# EAGLE design xy-pad (EAGLE 9.6.2)
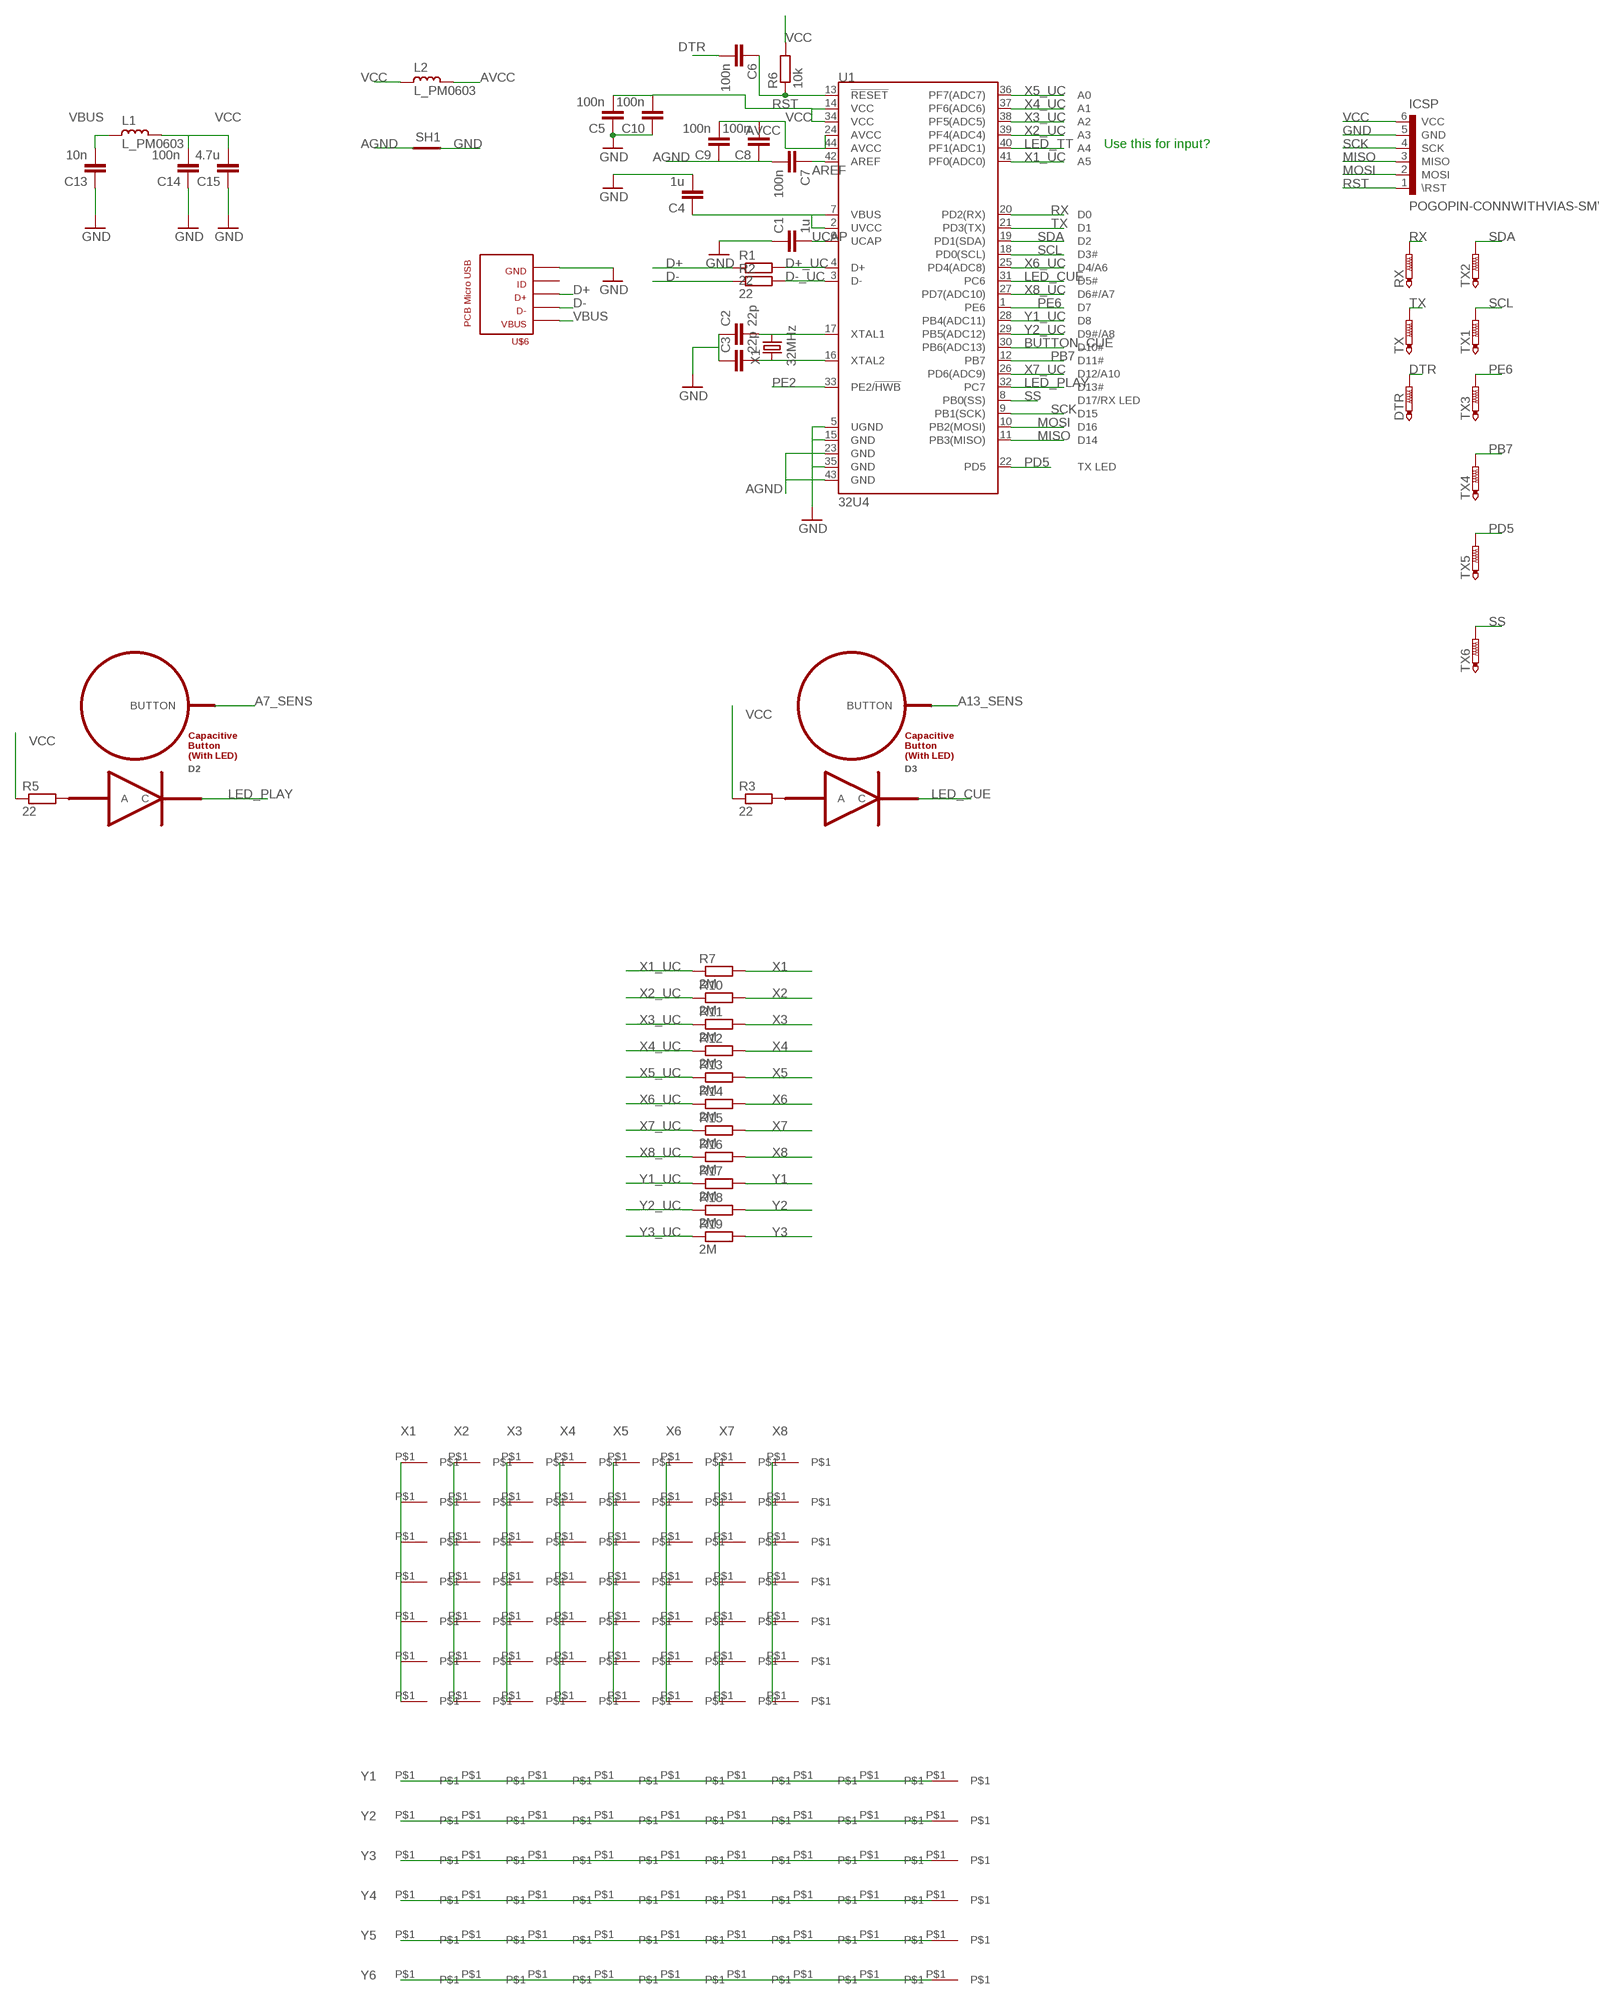
[diagram p0: schematic, sheet 1]

## Parts
C1  1u  C-EUC0402  [C0402]
C2  22p  C-EUC0402  [C0402]
C3  22p  C-EUC0402  [C0402]
C4  1u  C-EUC0402  [C0402]
C5  100n  C-EUC0402  [C0402]
C6  100n  C-EUC0402  [C0402]
C7  100n  C-EUC0402  [C0402]
C8  100n  C-EUC0402  [C0402]
C9  100n  C-EUC0402  [C0402]
C10  100n  C-EUC0402  [C0402]
C13  10n  C-EUC0402  [C0402]
C14  100n  C-EUC0402  [C0402]
C15  4.7u  C-EUC0402  [C0402]
D2  LED_BUTTON  [LED_BUTTON]
D3  LED_BUTTON  [LED_BUTTON]
DTR  PTR1TP06R  [TP06R]
ICSP  POGOPIN-CONNWITHVIAS-SMV  [POGOPROG-CONN-OH-SMALLERVIAS]
L1  L_PM0603  [PM0603]
L2  L_PM0603  [PM0603]
R1  22  R-EU_R0402  [R0402]
R2  22  R-EU_R0402  [R0402]
R3  22  R-EU_R0402  [R0402]
R5  22  R-EU_R0402  [R0402]
R6  10k  R-EU_R0402  [R0402]
R7  2M  R-EU_R0402  [R0402]
R10  2M  R-EU_R0402  [R0402]
R11  2M  R-EU_R0402  [R0402]
R12  2M  R-EU_R0402  [R0402]
R13  2M  R-EU_R0402  [R0402]
R14  2M  R-EU_R0402  [R0402]
R15  2M  R-EU_R0402  [R0402]
R16  2M  R-EU_R0402  [R0402]
R17  2M  R-EU_R0402  [R0402]
R18  2M  R-EU_R0402  [R0402]
R19  2M  R-EU_R0402  [R0402]
RX  PTR1TP06R  [TP06R]
SH1  SHORT  [SHORT_TOP-6]
TX  PTR1TP06R  [TP06R]
TX1  PTR1TP06R  [TP06R]
TX2  PTR1TP06R  [TP06R]
TX3  PTR1TP06R  [TP06R]
TX4  PTR1TP06R  [TP06R]
TX5  PTR1TP06R  [TP06R]
TX6  PTR1TP06R  [TP06R]
U1  32U4  ATMEGA32U4QFN  [QFN-44]
U$1  XY_PAD  [DIAMOND_PAD]
U$2  XY_PADTRIANGLE  [TRIANGLE_PAD]
U$3  XY_PADTRIANGLE  [TRIANGLE_PAD]
U$4  XY_PADTRIANGLE  [TRIANGLE_PAD]
U$5  XY_PADTRIANGLE  [TRIANGLE_PAD]
U$6  PCB_MICRO_USB_BSS_2  [USB_TYPE_B_SS_2]
U$7  XY_PADTRIANGLE  [TRIANGLE_PAD]
U$8  XY_PADTRIANGLE  [TRIANGLE_PAD]
U$9  XY_PADTRIANGLE  [TRIANGLE_PAD]
U$10  XY_PADTRIANGLE  [TRIANGLE_PAD]
U$11  XY_PAD  [DIAMOND_PAD]
U$12  XY_PAD  [DIAMOND_PAD]
U$13  XY_PAD  [DIAMOND_PAD]
U$14  XY_PAD  [DIAMOND_PAD]
U$15  XY_PAD  [DIAMOND_PAD]
U$16  XY_PAD  [DIAMOND_PAD]
U$17  XY_PAD  [DIAMOND_PAD]
U$18  XY_PAD  [DIAMOND_PAD]
U$19  XY_PAD  [DIAMOND_PAD]
U$20  XY_PAD  [DIAMOND_PAD]
U$21  XY_PAD  [DIAMOND_PAD]
U$22  XY_PAD  [DIAMOND_PAD]
U$23  XY_PAD  [DIAMOND_PAD]
U$24  XY_PAD  [DIAMOND_PAD]
U$25  XY_PAD  [DIAMOND_PAD]
U$26  XY_PAD  [DIAMOND_PAD]
U$27  XY_PAD  [DIAMOND_PAD]
U$28  XY_PAD  [DIAMOND_PAD]
U$29  XY_PAD  [DIAMOND_PAD]
U$30  XY_PAD  [DIAMOND_PAD]
U$31  XY_PAD  [DIAMOND_PAD]
U$32  XY_PAD  [DIAMOND_PAD]
U$33  XY_PAD  [DIAMOND_PAD]
U$34  XY_PAD  [DIAMOND_PAD]
U$35  XY_PAD  [DIAMOND_PAD]
U$36  XY_PAD  [DIAMOND_PAD]
U$37  XY_PAD  [DIAMOND_PAD]
U$38  XY_PAD  [DIAMOND_PAD]
U$39  XY_PAD  [DIAMOND_PAD]
U$40  XY_PAD  [DIAMOND_PAD]
U$41  XY_PAD  [DIAMOND_PAD]
U$42  XY_PAD  [DIAMOND_PAD]
U$43  XY_PAD  [DIAMOND_PAD]
U$44  XY_PAD  [DIAMOND_PAD]
U$45  XY_PAD  [DIAMOND_PAD]
U$46  XY_PAD  [DIAMOND_PAD]
U$47  XY_PAD  [DIAMOND_PAD]
U$48  XY_PAD  [DIAMOND_PAD]
U$49  XY_PAD  [DIAMOND_PAD]
U$50  XY_PADTRIANGLE  [TRIANGLE_PAD]
U$51  XY_PADTRIANGLE  [TRIANGLE_PAD]
U$52  XY_PADTRIANGLE  [TRIANGLE_PAD]
U$53  XY_PADTRIANGLE  [TRIANGLE_PAD]
U$54  XY_PADTRIANGLE  [TRIANGLE_PAD]
U$55  XY_PADTRIANGLE  [TRIANGLE_PAD]
U$56  XY_PADTRIANGLE  [TRIANGLE_PAD]
U$57  XY_PADTRIANGLE  [TRIANGLE_PAD]
U$58  XY_PADTRIANGLE  [TRIANGLE_PAD]
U$59  XY_PADTRIANGLE  [TRIANGLE_PAD]
U$60  XY_PADTRIANGLE  [TRIANGLE_PAD]
U$61  XY_PADTRIANGLE  [TRIANGLE_PAD]
U$62  XY_PADTRIANGLE  [TRIANGLE_PAD]
U$63  XY_PADTRIANGLE  [TRIANGLE_PAD]
U$64  XY_PAD  [DIAMOND_PAD]
U$65  XY_PAD  [DIAMOND_PAD]
U$66  XY_PAD  [DIAMOND_PAD]
U$67  XY_PAD  [DIAMOND_PAD]
U$68  XY_PAD  [DIAMOND_PAD]
U$69  XY_PAD  [DIAMOND_PAD]
U$70  XY_PAD  [DIAMOND_PAD]
U$71  XY_PAD  [DIAMOND_PAD]
U$72  XY_PAD  [DIAMOND_PAD]
U$73  XY_PAD  [DIAMOND_PAD]
U$74  XY_PAD  [DIAMOND_PAD]
U$75  XY_PAD  [DIAMOND_PAD]
U$76  XY_PAD  [DIAMOND_PAD]
U$77  XY_PAD  [DIAMOND_PAD]
U$78  XY_PAD  [DIAMOND_PAD]
U$79  XY_PAD  [DIAMOND_PAD]
U$80  XY_PAD  [DIAMOND_PAD]
U$81  XY_PAD  [DIAMOND_PAD]
U$82  XY_PAD  [DIAMOND_PAD]
U$83  XY_PAD  [DIAMOND_PAD]
U$84  XY_PAD  [DIAMOND_PAD]
U$85  XY_PAD  [DIAMOND_PAD]
U$86  XY_PAD  [DIAMOND_PAD]
U$87  XY_PAD  [DIAMOND_PAD]
U$88  XY_PAD  [DIAMOND_PAD]
U$89  XY_PAD  [DIAMOND_PAD]
U$90  XY_PAD  [DIAMOND_PAD]
U$91  XY_PAD  [DIAMOND_PAD]
U$92  XY_PAD  [DIAMOND_PAD]
U$93  XY_PAD  [DIAMOND_PAD]
U$94  XY_PAD  [DIAMOND_PAD]
U$95  XY_PAD  [DIAMOND_PAD]
U$96  XY_PAD  [DIAMOND_PAD]
U$97  XY_PAD  [DIAMOND_PAD]
U$98  XY_PAD  [DIAMOND_PAD]
U$99  XY_PAD  [DIAMOND_PAD]
U$100  XY_PAD  [DIAMOND_PAD]
U$101  XY_PAD  [DIAMOND_PAD]
U$102  XY_PAD  [DIAMOND_PAD]
U$103  XY_PAD  [DIAMOND_PAD]
U$104  XY_PAD  [DIAMOND_PAD]
U$105  XY_PAD  [DIAMOND_PAD]
U$106  XY_PADTRIANGLE  [TRIANGLE_PAD]
U$107  XY_PADTRIANGLE  [TRIANGLE_PAD]
U$108  XY_PADTRIANGLE  [TRIANGLE_PAD]
U$109  XY_PADTRIANGLE  [TRIANGLE_PAD]
U$110  XY_PADTRIANGLE  [TRIANGLE_PAD]
U$111  XY_PADTRIANGLE  [TRIANGLE_PAD]
X1  32MHz  CRYSTAL-32MHZ-SMD-2.0X1.6MM  [CRYSTAL-SMD-2.0X1.6MM]

## Nets
A7_SENS: D2.BUTTON
A13_SENS: D3.BUTTON
AGND: C7.2 C8.1 C9.1 SH1.1 U1.23(GND) U1.43(GND)
AREF: C7.1 U1.42(AREF)
AVCC: C8.2 C9.2 L2.1 U1.24(AVCC) U1.44(AVCC)
BUTTON_CUE: U1.30(PB6(ADC13))
D+: R1.1 U$6.3
D+_UC: R1.2 U1.4(D+)
D-: R2.1 U$6.2
D-_UC: R2.2 U1.3(D-)
DTR: C6.2 DTR.TP
GND: C1.1 C2.1 C3.1 C4.2 C5.1 C10.1 C13.1 C14.1 C15.1 ICSP.5(GND) SH1.2 U1.5(UGND) U1.15(GND) U1.35(GND) U$6.5
LED_CUE: D3.C U1.31(PC6)
LED_PLAY: D2.C U1.32(PC7)
LED_TT: U1.40(PF1(ADC1))
MISO: ICSP.3(MISO) U1.11(PB3(MISO))
MOSI: ICSP.2(MOSI) U1.10(PB2(MOSI))
N$6: D3.A R3.2
N$7: C2.2 U1.17(XTAL1) X1.3
N$8: C3.2 U1.16(XTAL2) X1.1
N$10: D2.A R5.2
PB7: TX4.TP U1.12(PB7)
PD5: TX5.TP U1.22(PD5)
PE2: U1.33(PE2/!HWB)
PE6: TX3.TP U1.1(PE6)
RST: C6.1 ICSP.1(\RST) R6.1 U1.13(!RESET)
RX: RX.TP U1.20(PD2(RX))
SCK: ICSP.4(SCK) U1.9(PB1(SCK))
SCL: TX1.TP U1.18(PD0(SCL))
SDA: TX2.TP U1.19(PD1(SDA))
SS: TX6.TP U1.8(PB0(SS))
TX: TX.TP U1.21(PD3(TX))
UCAP: C1.2 U1.6(UCAP)
VBUS: C13.2 L1.2 U$6.1
VCC: C4.1 C5.2 C10.2 C14.2 C15.2 ICSP.6(VCC) L1.1 L2.2 R3.1 R5.1 R6.2 U1.2(UVCC) U1.7(VBUS) U1.14(VCC) U1.34(VCC)
X1: R7.2 U$1.P$1 U$2.P$1 U$18.P$1 U$26.P$1 U$34.P$1 U$42.P$1 U$50.P$1
X1_UC: R7.1 U1.41(PF0(ADC0))
X2: R10.2 U$3.P$1 U$11.P$1 U$19.P$1 U$27.P$1 U$35.P$1 U$43.P$1 U$51.P$1
X2_UC: R10.1 U1.39(PF4(ADC4))
X3: R11.2 U$4.P$1 U$12.P$1 U$20.P$1 U$28.P$1 U$36.P$1 U$44.P$1 U$52.P$1
X3_UC: R11.1 U1.38(PF5(ADC5))
X4: R12.2 U$5.P$1 U$13.P$1 U$21.P$1 U$29.P$1 U$37.P$1 U$45.P$1 U$53.P$1
X4_UC: R12.1 U1.37(PF6(ADC6))
X5: R13.2 U$7.P$1 U$14.P$1 U$22.P$1 U$30.P$1 U$38.P$1 U$46.P$1 U$54.P$1
X5_UC: R13.1 U1.36(PF7(ADC7))
X6: R14.2 U$8.P$1 U$15.P$1 U$23.P$1 U$31.P$1 U$39.P$1 U$47.P$1 U$55.P$1
X6_UC: R14.1 U1.25(PD4(ADC8))
X7: R15.2 U$9.P$1 U$16.P$1 U$24.P$1 U$32.P$1 U$40.P$1 U$48.P$1 U$56.P$1
X7_UC: R15.1 U1.26(PD6(ADC9))
X8: R16.2 U$10.P$1 U$17.P$1 U$25.P$1 U$33.P$1 U$41.P$1 U$49.P$1 U$57.P$1
X8_UC: R16.1 U1.27(PD7(ADC10))
Y1: R17.2 U$63.P$1 U$69.P$1 U$75.P$1 U$81.P$1 U$87.P$1 U$93.P$1 U$99.P$1 U$105.P$1 U$111.P$1
Y1_UC: R17.1 U1.28(PB4(ADC11))
Y2: R18.2 U$62.P$1 U$68.P$1 U$74.P$1 U$80.P$1 U$86.P$1 U$92.P$1 U$98.P$1 U$104.P$1 U$110.P$1
Y2_UC: R18.1 U1.29(PB5(ADC12))
Y3: R19.2 U$61.P$1 U$67.P$1 U$73.P$1 U$79.P$1 U$85.P$1 U$91.P$1 U$97.P$1 U$103.P$1 U$109.P$1
Y3_UC: R19.1
Y4: U$60.P$1 U$66.P$1 U$72.P$1 U$78.P$1 U$84.P$1 U$90.P$1 U$96.P$1 U$102.P$1 U$108.P$1
Y5: U$59.P$1 U$65.P$1 U$71.P$1 U$77.P$1 U$83.P$1 U$89.P$1 U$95.P$1 U$101.P$1 U$107.P$1
Y6: U$58.P$1 U$64.P$1 U$70.P$1 U$76.P$1 U$82.P$1 U$88.P$1 U$94.P$1 U$100.P$1 U$106.P$1
Unconnected: U$6.4

## Notes on the sheet
- Use this for input?

## Library data of the parts
C1-C10 C13-C15 = rcl:C-EU: CAPACITOR, European symbol; SPICEPREFIX: C
D2 D3 = credit_card_midi:LED_BUTTON
DTR RX TX TX1-TX6 = testpad:PTR1: TEST PIN
ICSP = Protofusion:POGOPIN-CONN: Protofusion custom pogo pin programming header
L1 L2 = rc-master-smd:L_: INDUCTOR
R1-R3 R5-R7 R10-R19 = rcl:R-EU_: RESISTOR, European symbol; SPICEPREFIX: R
SH1 = shorts:SHORT: Short between two nets
U1 = SparkFun-IC-Microcontroller:ATMEGA32U4: Atmel MCU, 32KByte Atmel 44-pin 8-bit Microcontroller with 32KBytes of ISP Flash and USB Controller Datasheet <http://cdn.sparkfun.com/datasheets/Dev/Arduino/Boards/ATMega32U4.pdf> SparkFun Products LilyPad Arduino USB - ATmega32U4 Board <https://www.sparkfun.com/products/12049> (DEV-12049) Pro Micro - 5V/16MHz <https://www.sparkfun.com/products/12640> (DEV-12640) Pro Micro - 3.3V/8MHz <https://www.sparkfun.com/products/12587> (DEV-12587) Fio v3 - ATmega32U4 <https://www.sparkfun.com/products/11520> (DEV-11520) Qduino Mini <https://www.sparkfun.com/products/13614> (DEV-13614) Makey Makey - Standard Kit <https://www.sparkfun.com/products/11511> (WIG-11511) Makey Makey Deluxe Kit <https://www.sparkfun.com/products/11519> (WIG-11519); PROD_ID: IC-10828
U$1-U$5 U$7-U$111 = credit_card_midi:XY_PAD
U$6 = USB_pcb_connectors:PCB_MICRO_USB_B
X1 = SparkFun-Clocks:CRYSTAL-32MHZ: 32MHz Crystal Digikey Example <http://www.digikey.com/product-detail/en/murata-electronics-north-america/XRCGB32M000F2P00R0/490-9769-1-ND/4952013> Frequency: 32MHz Frequency Stability: ±20ppm Frequency Tolerance: ±20ppm Load Capacitance: 6pF SparkFun Products SparkFun nRF52832 Breakout <https://www.sparkfun.com/products/13990>; PROD_ID: XTAL-13459

## Board
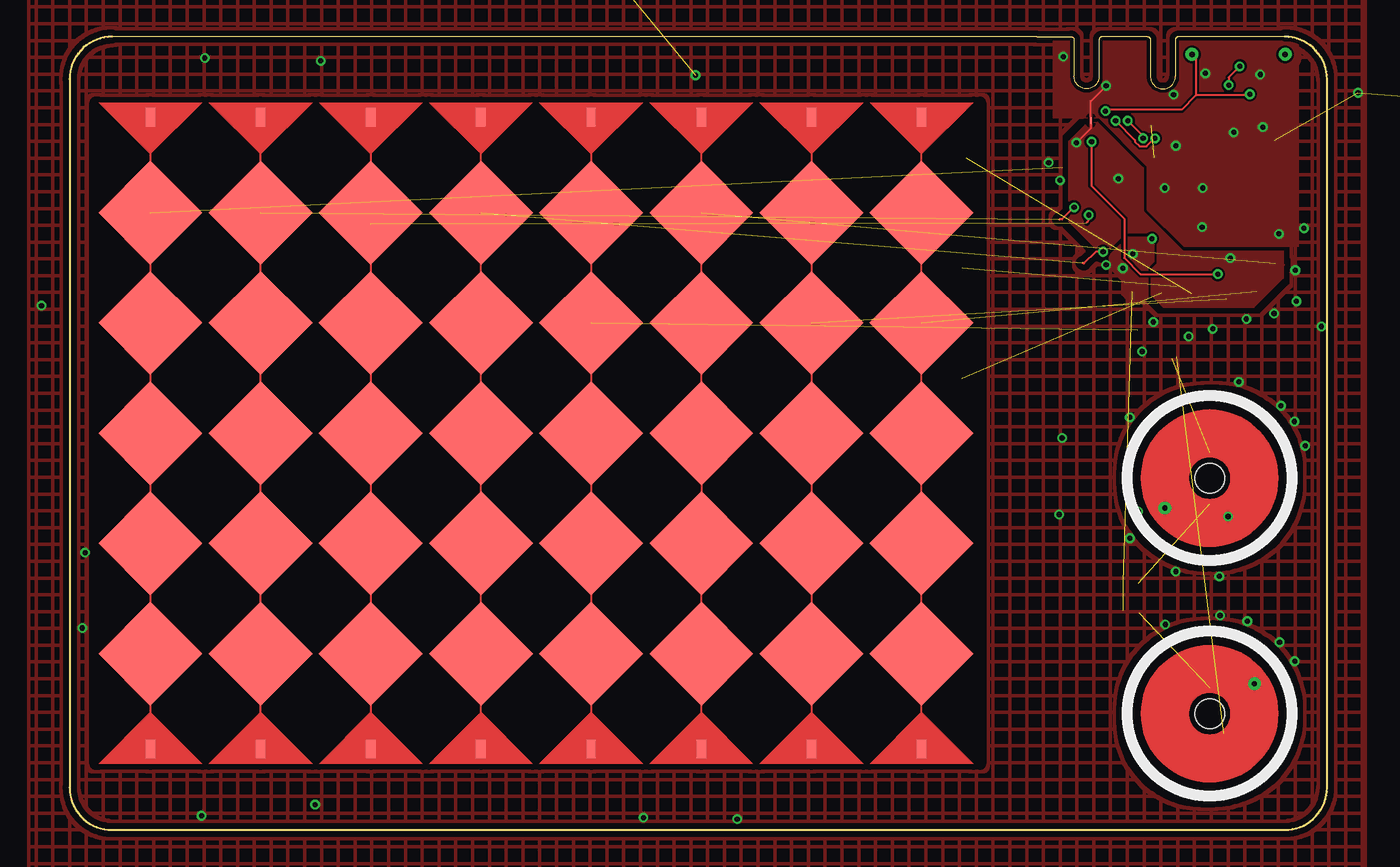
[diagram p1: board, top side]
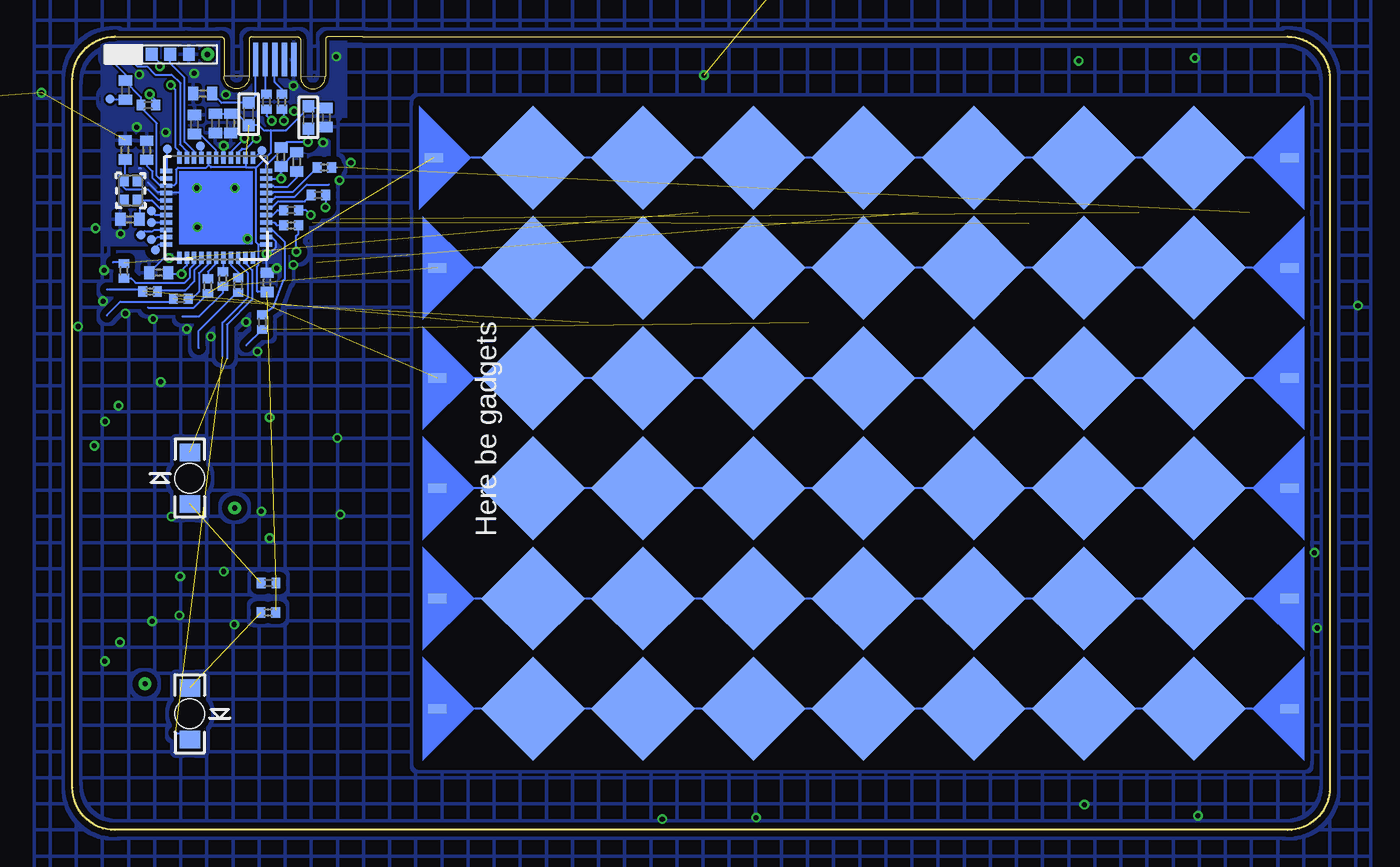
[diagram p2: board, bottom side, seen from below]

Size 85.6 x 53.98 mm. Coordinates in mm from the lower left corner, seen from the top.
Outline: 77.83,53.98 82.72,53.98 arc-90 85.6,51.1 85.6,2.88 arc-90 82.72,0 2.88,0 arc-90 0,2.88 0,51.1 arc-90 2.88,53.98 65.84,53.98
Copper layers (1*16): Top 0.035mm / dielectric 1.5mm / Bottom 0.035mm
Design rules "SeeedStudio_2layer_DRU_no_angle_20140221": minimum track width 6mil, minimum drill 12mil, track to track 6mil, track to pad 6mil, pad to pad 6mil, via to via 6mil, smd to smd 0mil, copper to edge 10mil, drill to drill 10mil, minimum pad ring 10mil, minimum via ring 6mil, stop-mask expansion 2mil, vias tented up to drill 100mil, thermal gap 10mil
tRestrict: area 1.8,4.5 to 62,49.5
bRestrict: area 1.8,4.5 to 62,49.5

### Footprints (pad centres in the part's own frame; a part is rotated, then mirrored left to right if it is on the bottom)
C0402 = smd 0.7 x 0.9: 1 -0.65,0; 2 0.65,0
LED_BUTTON = smd 1.2 x 1.4 bottom: A -1.754,0; C 1.754,0 | drill 0.356: BUTTON -2.032,3.048 | hole 2: 0,0
TP06R = smd 0.6 x 0.6: TP 0,0
POGOPROG-CONN-OH-SMALLERVIAS = drill 0.381: 1 0,2.54; 6 0,-3.81 | smd 0.889 x 0.813: 2 0,1.27; 3 0,0; 4 0,-1.27; 5 0,-2.54
PM0603 = smd 0.8 x 0.8: 1 -0.762,0; 2 0.762,0
R0402 = smd 0.6 x 0.7: 1 -0.5,0; 2 0.5,0
SHORT_TOP-6 = smd 0.305 x 0.152: 1 0.051,0; 2 -0.076,0
QFN-44 = smd 0.8 x 0.3: 1 -3.4,2.5; 2 -3.4,2; 3 -3.4,1.5; 4 -3.4,1; 5 -3.4,0.5; 6 -3.4,0; 7 -3.4,-0.5; 8 -3.4,-1; 9 -3.4,-1.5; 10 -3.4,-2; 11 -3.4,-2.5; 23 3.4,-2.5; 24 3.4,-2; 25 3.4,-1.5; 26 3.4,-1; 27 3.4,-0.5; 28 3.4,0; 29 3.4,0.5; 30 3.4,1; 31 3.4,1.5; 32 3.4,2; 33 3.4,2.5 | smd 0.3 x 0.8: 12 -2.5,-3.4; 13 -2,-3.4; 14 -1.5,-3.4; 15 -1,-3.4; 16 -0.5,-3.4; 17 0,-3.4; 18 0.5,-3.4; 19 1,-3.4; 20 1.5,-3.4; 21 2,-3.4; 22 2.5,-3.4; 34 2.5,3.4; 35 2,3.4; 36 1.5,3.4; 37 1,3.4; 38 0.5,3.4; 39 0,3.4; 40 -0.5,3.4; 41 -1,3.4; 42 -1.5,3.4; 43 -2,3.4; 44 -2.5,3.4
DIAMOND_PAD = smd 5 x 5 rotated 45: P$1 0,0
TRIANGLE_PAD = smd 1.27 x 0.635: P$1 1,0
USB_TYPE_B_SS_2 = smd 0.37 x 2.3: 1 -1.3,-1.55; 2 -0.65,-1.55; 3 0,-1.55; 4 0.65,-1.55; 5 1.3,-1.55
CRYSTAL-SMD-2.0X1.6MM = smd 0.75 x 0.7: 1 -0.675,-0.5; 2 0.675,-0.5; 3 0.675,0.5; 4 -0.675,0.5

### Placement (x,y rotation side)
C1  77.29,48.01 270 bottom
C2  81.69,41.55 0 bottom
C3  82.02,46.28 270 bottom
C4  68.33,48.49 270 bottom
C5  80.54,46.25 270 bottom
C6  81.99,50.34 270 bottom
C7  70.33,45.47 90 bottom
C8  79.73,37.92 0 bottom
C9  71.4,45.8 90 bottom
C10  72.35,37.26 270 bottom
C13  76.73,50.11 0 bottom
C14  75.87,48.08 90 bottom
C15  74.83,48.08 90 bottom
D2  77.61,23.94 90 top
D3  77.61,7.91 270 top
DTR  83.03,49.73 0 bottom
ICSP  80.21,52.78 90 bottom
L1  73.61,48.72 90 bottom
L2  69.55,48.49 90 bottom
R1  71.35,49.56 270 bottom
R2  72.39,49.56 270 bottom
R3  72.28,14.8 180 bottom
R5  72.25,16.8 180 bottom
R6  80.44,49.33 0 bottom
R7  68.45,45.09 0 bottom
R10  68.86,43.21 0 bottom
R11  70.71,42.18 0 bottom
R12  70.71,41.15 0 bottom
R13  72.68,34.56 270 bottom
R14  82.09,38.05 90 bottom
R15  80.31,36.65 180 bottom
R16  78.23,36.14 180 bottom
R17  76.38,37.01 270 bottom
R18  75.35,37.49 270 bottom
R19  74.32,37.07 270 bottom
RX  80.95,40.49 0 bottom
SH1  69.52,48.27 270 top
TX  80.24,40.18 0 bottom
TX1  80.24,42.11 0 bottom
TX2  80.21,41.35 0 bottom
TX3  72.69,46.25 0 bottom
TX4  79.15,46.33 0 bottom
TX5  79.96,39.47 0 bottom
TX6  76.89,46.53 0 bottom
U1  75.82,42.34 270 bottom
U$1  5.5,42 0 top
U$2  5.5,49.5 270 top
U$3  13,49.5 270 top
U$4  20.5,49.5 270 top
U$5  28,49.5 270 top
U$6  71.83,53.98 0 bottom
U$7  35.5,49.5 270 top
U$8  43,49.5 270 top
U$9  58,49.5 270 top
U$10  50.5,49.5 270 top
U$11  13,42 0 top
U$12  20.5,42 0 top
U$13  28,42 0 top
U$14  35.5,42 0 top
U$15  43,42 0 top
U$16  58,42 0 top
U$17  50.5,42 0 top
U$18  5.5,34.5 180 top
U$19  13,34.5 90 top
U$20  20.5,34.5 90 top
U$21  28,34.5 90 top
U$22  35.5,34.5 90 top
U$23  43,34.5 90 top
U$24  58,34.5 90 top
U$25  50.5,34.5 90 top
U$26  5.5,27 90 top
U$27  13,27 90 top
U$28  20.5,27 90 top
U$29  28,27 90 top
U$30  35.5,27 90 top
U$31  43,27 90 top
U$32  58,27 90 top
U$33  50.5,27 90 top
U$34  5.5,19.5 90 top
U$35  13,19.5 90 top
U$36  20.5,19.5 90 top
U$37  28,19.5 90 top
U$38  35.5,19.5 90 top
U$39  43,19.5 90 top
U$40  58,19.5 90 top
U$41  50.5,19.5 90 top
U$42  5.5,12 0 top
U$43  13,12 0 top
U$44  20.5,12 0 top
U$45  28,12 0 top
U$46  35.5,12 0 top
U$47  43,12 0 top
U$48  58,12 0 top
U$49  50.5,12 0 top
U$50  5.5,4.5 90 top
U$51  13,4.5 90 top
U$52  20.5,4.5 90 top
U$53  28,4.5 90 top
U$54  35.5,4.5 90 top
U$55  43,4.5 90 top
U$56  58,4.5 90 top
U$57  50.5,4.5 90 top
U$58  1.75,8.25 180 bottom
U$59  1.75,15.75 180 bottom
U$60  1.75,23.25 180 bottom
U$61  1.75,30.75 180 bottom
U$62  1.75,38.25 180 bottom
U$63  1.75,45.75 180 bottom
U$64  9.25,8.25 0 bottom
U$65  9.25,15.75 0 bottom
U$66  9.25,23.25 0 bottom
U$67  9.25,30.75 0 bottom
U$68  9.25,38.25 0 bottom
U$69  9.25,45.75 0 bottom
U$70  16.75,8.25 0 bottom
U$71  16.75,15.75 0 bottom
U$72  16.75,23.25 0 bottom
U$73  16.75,30.75 0 bottom
U$74  16.75,38.25 0 bottom
U$75  16.75,45.75 0 bottom
U$76  24.25,8.25 0 bottom
U$77  24.25,15.75 0 bottom
U$78  24.25,23.25 0 bottom
U$79  24.25,30.75 0 bottom
U$80  24.25,38.25 0 bottom
U$81  24.25,45.75 0 bottom
U$82  31.75,8.25 0 bottom
U$83  31.75,15.75 0 bottom
U$84  31.75,23.25 0 bottom
U$85  31.75,30.75 0 bottom
U$86  31.75,38.25 0 bottom
U$87  31.75,45.75 0 bottom
U$88  39.25,8.25 0 bottom
U$89  39.25,15.75 0 bottom
U$90  39.25,23.25 0 bottom
U$91  39.25,30.75 0 bottom
U$92  39.25,38.25 0 bottom
U$93  39.25,45.75 0 bottom
U$94  46.75,8.25 0 bottom
U$95  46.75,15.75 0 bottom
U$96  46.75,23.25 0 bottom
U$97  46.75,30.75 0 bottom
U$98  46.75,38.25 0 bottom
U$99  46.75,45.75 0 bottom
U$100  54.25,8.25 0 bottom
U$101  54.25,15.75 0 bottom
U$102  54.25,23.25 0 bottom
U$103  54.25,30.75 0 bottom
U$104  54.25,38.25 0 bottom
U$105  54.25,45.75 0 bottom
U$106  61.75,8.25 0 bottom
U$107  61.75,15.75 0 bottom
U$108  61.75,23.25 0 bottom
U$109  61.75,30.75 0 bottom
U$110  61.75,38.25 0 bottom
U$111  62,45.75 0 bottom
X1  81.64,43.51 270 bottom

### Tracks (layer width: path | path; a pad name or v marks a point on that pad's centre or on a via)
A7_SENS
  Bottom 0.152: 74.51,21.96 D2.BUTTON
A13_SENS
  Bottom 0.152: 80.68,9.94 D3.BUTTON
AGND  (via drill 0.35)
  Top 0.152: SH1.1 69.52,47.76 v68.54,46.78
  Bottom 0.152: U1.43 72.4,44.33 v71.4,44.33 C9.1 70.43,46.12 C7.2 | v79.02,38.91 79.39,38.91 C8.1
  pour Bottom (isolate 0.406): 82.6,38.38 82.6,37.57 80.59,35.56 74.5,35.56 73.69,36.37 73.69,38.15 74.09,38.56 74.09,40.64 71.86,40.64 70.84,39.62 69.82,39.62 68.05,41.4 68.05,46.86 68.66,47.47 70.64,47.47 73.08,45.03 73.08,42.09 75.77,39.4 82.61,39.4 82.6,39.38 82.6,38.53 82.68,38.45
  pour Top: 82.6,38.38 82.6,37.57 80.59,35.56 74.5,35.56 73.69,36.37 73.69,38.15 74.09,38.56 74.09,40.64 71.86,40.64 70.84,39.62 69.82,39.62 68.05,41.4 68.05,46.86 69.32,48.13 69.98,48.13 73.08,45.03 73.08,42.09 75.77,39.4 82.61,39.4 82.6,39.38 82.6,38.53 82.68,38.45
AREF
  Bottom 0.152: U1.42 71.93,43.84 71.86,43.77 70.96,43.77 70.33,44.4 C7.1
AVCC  (via drill 0.35)
  Top 0.152: v69.57,46.83 69.57,43.83 71.79,41.6 71.79,38.93 72.9,37.82 v78.16,37.82
  Bottom 0.152: U1.44 72.42,45.25 71.4,46.27 C9.2 71.01,46.83 v69.57,46.83 69.57,47.73 L2.1 | U1.24 77.82,38.42 78.16,38.08 78.16,37.85 | 78.16,37.85 v78.16,37.82 | C8.2 79,37.85 78.16,37.85
BUTTON_CUE
  Bottom 0.152: U1.30 74.82,38.45 74.29,37.91 74.29,37.6
D+
  Bottom 0.152: R1.1 71.35,50.41 71.83,50.89 U$6.3
D+_UC  (via drill 0.35)
  Top 0.152: v73.89,47.07 73.86,47.07 73.31,46.52 72.85,46.52 72.53,46.84 72.53,46.95 v71.21,48.27
  Bottom 0.152: U1.4 74.82,46.14 v73.89,47.07 | v71.21,48.27 71.22,48.28 71.22,48.93 R1.2
D-
  Bottom 0.152: R2.1 72.47,50.13 72.47,52.41 U$6.2
D-_UC  (via drill 0.35)
  Top 0.152: v72.03,48.26 73.08,47.21 v73.08,47.08
  Bottom 0.152: U1.3 74.33,46.11 74.06,46.37 73.79,46.37 v73.08,47.08 | R2.2 72.39,48.62 v72.03,48.26
DTR
  Bottom 0.152: C6.2 82.73,49.69 82.77,49.73 DTR.TP
GND  (via drill 0.35)  (4 unrouted)
  Top 0.152: SH1.2 69.52,49.61 v70.56,50.65
  Bottom 0.152: U1.5 v75.32,46.55 v75.31,46.56 | 80.93,45.02 81.09,45.02 | 80.47,44.06 79.79,43.39 79.26,43.39 U1.15 79.24,43.36 77.47,43.36 v77.14,43.69 | C10.1 72.38,37.94 v72.38,39.2 72.28,39.1 71.77,39.61 71.77,40.07 72.04,40.34 U1.35
  other vias: 81.23,47.83 77.32,51.49 82.32,40.56 45.44,0.74 72.17,28.08 82.46,28.87 79.25,47.47 80.11,34.77 77.81,34.1 76.19,33.58 81.99,35.14 83.52,35.98 83.44,38.09 78.87,21.34 99.57,49.94 9.2,52.54 1.05,18.87 16.71,1.72 72.75,21.68 67.56,26.67 85.22,34.26 84.02,40.94 87.71,50.16 93.57,49.73 0.87,13.74 8.99,0.97 -1.91,35.68 17.09,52.34 83.38,27.8 79.59,30.49 67.36,21.46 72.17,19.85 74.59,13.98 75.3,17.59 78.27,17.26 78.32,14.59 37.38,57.75 66.65,45.42 42.61,51.36 74.55,43.69 84.11,26.15 70.56,38.46 77.09,41.02 73.69,40.23 81.05,51.41 67.64,52.63 73.77,34.57 75.16,50.04 67.42,44.21 71.7,38.23 82.37,12.78 83.4,11.48 39.06,0.84 73.01,32.56 80.18,14.2
  pour Top (isolate 0.406, rank 2, hatched): -2.77,56.59 -2.77,-3.02 88.19,-3.02 88.19,56.59
  pour Bottom (isolate 0.406, rank 2, hatched): -2.77,56.46 -2.77,-3.12 88.19,-3.12 88.19,56.46
  pour Top: 66.97,54.01 66.97,48.49 70.07,48.49 73.38,45.17 73.38,42.21 75.85,39.74 83.64,39.71 83.64,54.28 81.38,56.54 69.49,56.54
  pour Bottom: 66.97,54.01 66.97,48.49 70.07,48.49 73.38,45.17 73.38,42.21 75.85,39.74 83.62,39.71 83.62,54.33 81.41,56.54 69.49,56.54
  pour Top: 72.05,40.34 73.79,40.34 73.79,38.68 73.36,38.25 73.36,36.2 73.05,35.89 72.21,35.89 71.68,36.42 71.68,37.39 70.82,38.25 70.82,39.1
  pour Bottom: 72.03,40.31 73.79,40.31 73.79,38.68 73.36,38.25 73.36,36.2 73.05,35.89 72.21,35.89 71.68,36.42 71.68,37.39 70.82,38.25 70.82,39.1
LED_CUE  (1 unrouted)
  Bottom 0.152: 75.39,32.21 75.39,34.52 73.67,36.23 73.67,37.91 74.32,38.56 U1.31 | 78.58,6.58 78.03,6.58 D3.C
LED_PLAY  (1 unrouted)
  Bottom 0.152: U1.32 73.82,38.56 73.36,38.1 73.36,36.11 75.08,34.39 75.08,32.08
LED_TT
  Bottom 0.152: U1.40 72.04,42.84 71.78,43.1 70.47,43.1 69.65,43.92 68.16,43.92
MISO  (via drill 0.35)
  Top 0.152: v79.66,51.97 78.91,51.22 v78.91,50.68
  Bottom 0.152: U1.11 78.32,46.17 78.6,46.46 78.6,50.38 v78.91,50.68 | ICSP.3 79.66,52.23 v79.66,51.97
MOSI
  Bottom 0.152: ICSP.2 81.48,52.27 81.18,51.97 80.52,51.97 79.96,51.41 78.85,51.41 78.28,50.84 78.28,46.65 77.82,46.2 U1.10
N$6  (1 unrouted)
N$7
  Bottom 0.152: U1.17 79.69,42.34 80.19,42.84 X1.3 81.14,42.73 81.09,42.69 81.04,42.67 C2.2
N$8
  Bottom 0.152: C3.2 82.02,44.4 82.14,44.28 X1.1 82.14,43.78 81.94,43.58 80.45,43.58 79.74,42.87 79.24,42.87 U1.16
N$10  (1 unrouted)
PB7
  Bottom 0.152: U1.12 79.15,44.91 TX4.TP
PD5
  Bottom 0.152: TX5.TP 79.96,39.61 79.73,39.84 U1.22
PE6
  Bottom 0.152: TX3.TP 73.21,45.74 U1.1
RST
  Bottom 0.152: ICSP.1 82.75,52.17 81.99,51.41 C6.1 82.01,50.94 80.94,49.88 R6.1 80.94,49.17 79.86,48.08 79.86,44.51 79.69,44.34 U1.13
RX
  Bottom 0.152: RX.TP 80.69,40.75 80.14,40.75 80.04,40.84 U1.20
SCK
  Bottom 0.152: ICSP.4 78.94,52.17 77.97,51.2 77.97,46.83 77.32,46.18 U1.9
SCL
  Bottom 0.152: U1.18 79.96,41.84 79.99,41.88 80,41.88 TX1.TP
SDA
  Bottom 0.152: TX2.TP U1.19
SS
  Bottom 0.152: U1.8 76.82,46.47 TX6.TP
TX
  Bottom 0.152: U1.21 79.83,40.34 79.98,40.18 TX.TP
UCAP
  Bottom 0.152: U1.6 75.82,46.25 76.92,47.36 C1.2
VBUS
  Bottom 0.152: U$6.1 73.13,49.96 L1.2 75.45,49.48 C13.2
VCC  (via drill 0.35)  (3 unrouted)
  Top 0.152: v80.34,50.07 80.29,50.01 76.68,50.01 | 76.68,50.01 76.68,52.5 ICSP.6 | v70.52,48.92 70.62,49.02 75.72,49.02 76.68,49.99 76.68,50.01
  Bottom 0.152: 73.78,45.09 76.17,45.09 76.32,45.24 | R6.2 | R6.2 79.94,49.66 v80.34,50.07 | R3.1 71.72,14.8 71.75,14.96 | 73.78,45.09 73.07,45.09 | 72.09,47.63 72.6,47.63 72.92,47.95 L1.1 74.39,48.73 C15.2 C14.2 | 72.09,47.63 72.09,46.07 73.07,45.09 73.09,45.11 73.09,39.99 72.94,39.84 | 70.14,48.55 71.06,47.63 72.09,47.63 | 70.14,48.55 69.55,49.14 L2.2 69.43,49.14 C4.1 | C10.2 72.97,36.61 73.05,36.69 73.05,38.34 72.94,38.45 72.94,39.84 | 72.94,39.84 U1.34 | C5.2 80.53,45.21 80.16,44.84 80.16,44.38 79.59,43.81 79.25,43.81 U1.14 78.72,43.84 78.55,44.01 78.55,44.94 78.41,45.07 76.49,45.07 76.32,45.24 | 76.32,45.24 U1.7 | v70.52,48.92 70.15,48.55 70.14,48.55 | 73.78,45.09 73.82,45.12 U1.2
X1  (1 unrouted)
  Top 0.152: U$2.P$1 U$1.P$1 U$18.P$1 U$26.P$1 U$34.P$1 | U$34.P$1 5.5,19 5.75,19 5.75,19.5 U$34.P$1 | U$34.P$1 U$42.P$1 U$50.P$1
  Bottom 0.152: R7.2 67.59,45.09
X1_UC
  Bottom 0.152: U1.41 71.97,43.34 71.91,43.4 70.61,43.4 68.95,45.06 R7.1
X2  (via drill 0.35)  (1 unrouted)
  Top 0.152: U$51.P$1 U$43.P$1 | 13,12.5 U$43.P$1 | U$43.P$1 U$35.P$1 U$27.P$1 U$19.P$1 U$11.P$1 U$3.P$1 | v68.38,42.37 67.56,41.55 67.44,41.55 67.36,41.55
  Bottom 0.152: R10.2 68.38,43.19 v68.38,42.37
X2_UC
  Bottom 0.152: U1.39 72.03,42.34 71.6,42.77 69.79,42.77 R10.1
X3  (via drill 0.35)  (1 unrouted)
  Top 0.152: U$4.P$1 U$12.P$1 | 20.5,41.25 U$12.P$1 | U$12.P$1 U$20.P$1 U$28.P$1 U$36.P$1 U$44.P$1 U$52.P$1 | v69.38,41.85 69.38,41.56 69.24,41.34
  Bottom 0.152: R11.2 70.19,42.2 69.74,42.2 v69.38,41.85
X3_UC
  Bottom 0.152: U1.38 71.97,41.84 71.63,42.18 R11.1
X4  (via drill 0.35)  (1 unrouted)
  Top 0.152: U$53.P$1 U$45.P$1 U$37.P$1 U$29.P$1 U$21.P$1 U$13.P$1 U$5.P$1 | v70.36,39.34 69.85,39.34 69.06,38.56 69.04,38.56 68.98,38.59
  Bottom 0.152: v70.36,39.34 70.36,40.44 70.21,40.58 R12.2
X4_UC
  Bottom 0.152: R12.1 71.66,41.13 71.87,41.34 U1.37
X5  (1 unrouted)
  Top 0.152: U$7.P$1 U$14.P$1 | 35.5,41.5 U$14.P$1 | U$14.P$1 U$22.P$1 U$30.P$1 U$38.P$1 U$46.P$1 | 35.5,11.5 U$46.P$1 | U$46.P$1 U$54.P$1
  Bottom 0.152: 73.76,32.98 R13.2
X5_UC
  Bottom 0.152: U1.36 71.99,40.84 71.13,39.98 71.14,39.98 71.14,37.5 71.21,37.43 71.89,35.61 R13.1
X6  (1 unrouted)
  Top 0.152: U$55.P$1 U$47.P$1 43,18.75 U$39.P$1 U$31.P$1 U$23.P$1 U$15.P$1 U$8.P$1
  Bottom 0.152: R14.2 82.17,38.62 82.85,38.62
X6_UC
  Bottom 0.152: U1.25 77.32,38.49 77.61,38.2 77.61,37.59 77.96,37.24 81.3,37.24 81.61,37.55 R14.1
X7  (1 unrouted)
  Top 0.152: U$56.P$1 U$48.P$1 U$40.P$1 U$32.P$1 U$24.P$1 U$16.P$1 U$9.P$1
  Bottom 0.152: R15.2 80.94,36.78 83.26,36.78
X7_UC
  Bottom 0.152: U1.26 76.82,38.56 77.3,38.08 77.3,37.33 77.9,36.73 79.74,36.73 R15.1
X8  (1 unrouted)
  Top 0.152: U$10.P$1 U$17.P$1 U$25.P$1 U$33.P$1 U$41.P$1 U$49.P$1 U$57.P$1
  Bottom 0.152: 83.26,35.03 82.33,35.95 78.92,35.95 R16.2
X8_UC
  Bottom 0.152: U1.27 76.34,38.94 76.34,38.53 76.98,37.9 76.98,36.64 77.48,36.14 R16.1
Y1  (1 unrouted)
  Bottom 0.152: U$63.P$1 U$69.P$1 U$75.P$1 U$81.P$1 U$87.P$1 U$93.P$1 U$99.P$1 U$105.P$1 U$111.P$1 | R17.2 77.34,35.54 80.46,35.54
Y1_UC
  Bottom 0.152: U1.28 75.82,38.56 76.38,38 R17.1
Y2  (1 unrouted)
  Bottom 0.152: U$62.P$1 U$68.P$1 U$74.P$1 U$80.P$1 U$86.P$1 U$92.P$1 U$98.P$1 U$104.P$1 U$110.P$1 | R18.2 75.35,36.56 76.97,34.95 78.12,34.95
Y2_UC
  Bottom 0.152: R18.1 75.32,38.02 U1.29
Y3  (1 unrouted)
  Bottom 0.152: U$61.P$1 U$67.P$1 U$73.P$1 U$79.P$1 U$85.P$1 U$91.P$1 U$97.P$1 U$103.P$1 U$109.P$1 | 77,32.79 77,33.98 74.41,36.57 R19.2
Y4
  Bottom 0.152: U$60.P$1 U$66.P$1 U$72.P$1 U$78.P$1 U$84.P$1 U$90.P$1 U$96.P$1 U$102.P$1 U$108.P$1
Y5
  Bottom 0.152: U$59.P$1 U$65.P$1 U$71.P$1 U$77.P$1 U$83.P$1 U$89.P$1 U$95.P$1 U$101.P$1 U$107.P$1
Y6
  Bottom 0.152: U$58.P$1 U$64.P$1 U$70.P$1 U$76.P$1 U$82.P$1 U$88.P$1 U$94.P$1 U$100.P$1 U$106.P$1

### Text on the board
bPlace: Here be gadgets